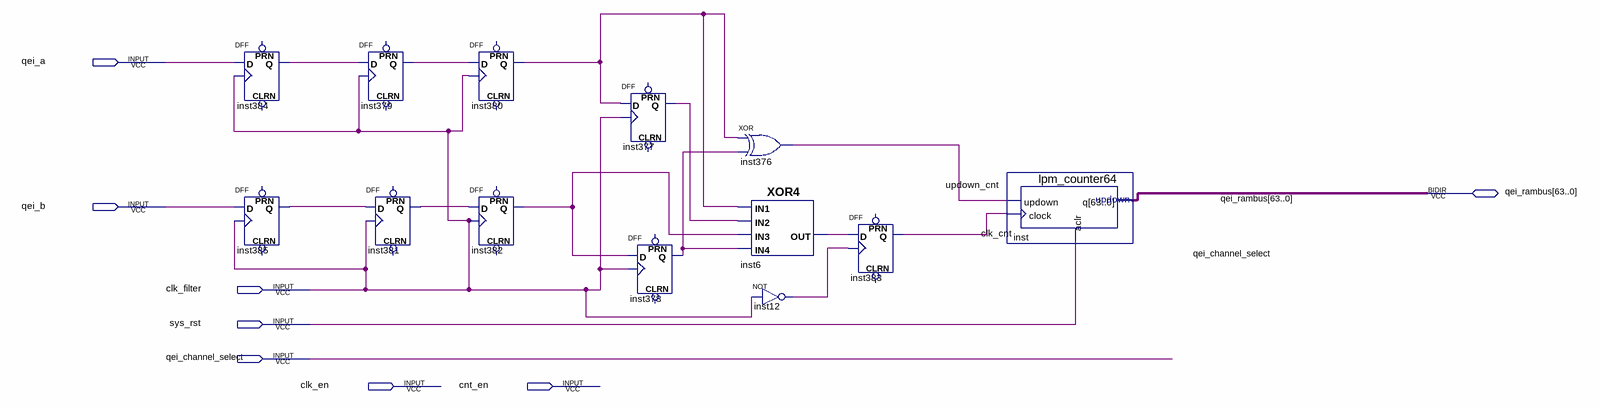
[diagram p0: schematic sheet]
// Quartus schematic qei_simple_bus128bit.bdf as structural Verilog: 13 symbols, 8 pins
module qei_simple_bus128bit (
  input  qei_a,
  input  qei_b,
  input  clk_filter,
  input  sys_rst,
  input  qei_channel_select,
  input  clk_en,
  input  cnt_en,
  inout  [63:0] qei_rambus
);

  wire clk_cnt, inst6_out, inst12_out, inst377_q, inst378_q, inst379_q, inst380_q, inst381_q, inst382_q,
       inst384_q, inst385_q, updown_cnt;

  DFF inst384 (.CLK(clk_filter), .D(qei_a), .Q(inst384_q));  // open: CLRN, PRN
  DFF inst385 (.CLK(clk_filter), .D(qei_b), .Q(inst385_q));  // open: CLRN, PRN
  DFF inst379 (.CLK(clk_filter), .D(inst384_q), .Q(inst379_q));  // open: CLRN, PRN
  DFF inst381 (.CLK(clk_filter), .D(inst385_q), .Q(inst381_q));  // open: CLRN, PRN
  DFF inst380 (.CLK(clk_filter), .D(inst379_q), .Q(inst380_q));  // open: CLRN, PRN
  DFF inst382 (.CLK(clk_filter), .D(inst381_q), .Q(inst382_q));  // open: CLRN, PRN
  DFF inst377 (.CLK(clk_filter), .D(inst380_q), .Q(inst377_q));  // open: CLRN, PRN
  DFF inst378 (.CLK(clk_filter), .D(inst382_q), .Q(inst378_q));  // open: CLRN, PRN
  xor inst376 (updown_cnt, inst380_q, inst378_q);
  XOR4 inst6 (.IN3(inst382_q), .IN4(inst378_q), .IN2(inst377_q), .IN1(inst380_q), .OUT(inst6_out));
  not inst12 (inst12_out, clk_filter);
  DFF inst383 (.CLK(inst12_out), .D(inst6_out), .Q(clk_cnt));  // open: CLRN, PRN
  lpm_counter64 inst (.updown(updown_cnt), .clock(clk_cnt), .aclr(sys_rst), .q(qei_rambus));
endmodule
